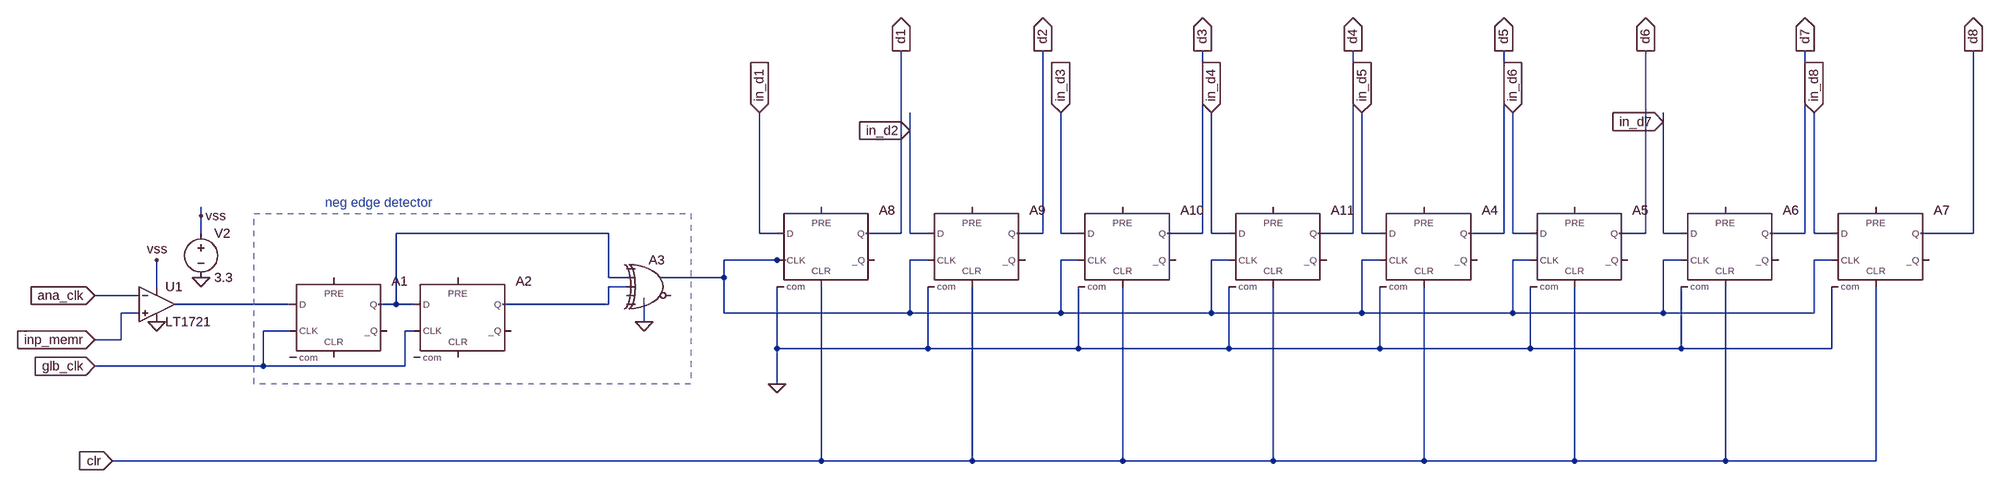
[diagram p0: schematic latch_cir.asc]
latch_cir.asc, the LTspice schematic file:
Version 4
SHEET 1 3932 680
WIRE 3312 -16 3312 -32
WIRE 1952 0 1952 -32
WIRE 672 176 672 160
WIRE 672 208 672 176
WIRE 1408 208 1024 208
WIRE 1680 208 1680 -32
WIRE 1712 208 1680 208
WIRE 1936 208 1936 -144
WIRE 1936 208 1872 208
WIRE 1952 208 1952 0
WIRE 1984 208 1952 208
WIRE 2192 208 2192 -144
WIRE 2192 208 2144 208
WIRE 2224 208 2224 -32
WIRE 2256 208 2224 208
WIRE 2480 208 2480 -144
WIRE 2480 208 2416 208
WIRE 2496 208 2496 -32
WIRE 2528 208 2496 208
WIRE 2752 208 2752 -144
WIRE 2752 208 2688 208
WIRE 2768 208 2768 -32
WIRE 2800 208 2768 208
WIRE 3024 208 3024 -144
WIRE 3024 208 2960 208
WIRE 3040 208 3040 -32
WIRE 3072 208 3040 208
WIRE 3280 208 3280 -144
WIRE 3280 208 3232 208
WIRE 3312 208 3312 -16
WIRE 3344 208 3312 208
WIRE 3568 208 3568 -144
WIRE 3568 208 3504 208
WIRE 3584 208 3584 -32
WIRE 3616 208 3584 208
WIRE 3872 208 3872 -144
WIRE 3872 208 3776 208
WIRE 1712 256 1616 256
WIRE 1728 256 1712 256
WIRE 1984 256 1952 256
WIRE 2256 256 2224 256
WIRE 2528 256 2496 256
WIRE 2800 256 2768 256
WIRE 3072 256 3040 256
WIRE 3344 256 3312 256
WIRE 3616 256 3584 256
WIRE 1408 288 1408 208
WIRE 1440 288 1408 288
WIRE 1616 288 1616 256
WIRE 1616 288 1504 288
WIRE 592 304 592 256
WIRE 1440 304 1408 304
WIRE 560 320 480 320
WIRE 832 336 624 336
WIRE 1024 336 1024 208
WIRE 1024 336 992 336
WIRE 1056 336 1024 336
WIRE 1408 336 1408 304
WIRE 1408 336 1216 336
WIRE 560 352 528 352
WIRE 1616 352 1616 288
WIRE 1952 352 1952 256
WIRE 1952 352 1616 352
WIRE 2224 352 2224 256
WIRE 2224 352 1952 352
WIRE 2496 352 2496 256
WIRE 2496 352 2224 352
WIRE 2768 352 2768 256
WIRE 2768 352 2496 352
WIRE 3040 352 3040 256
WIRE 3040 352 2768 352
WIRE 3312 352 3312 256
WIRE 3312 352 3040 352
WIRE 3584 352 3584 256
WIRE 3584 352 3312 352
WIRE 1472 368 1472 336
WIRE 832 384 784 384
WIRE 1056 384 1040 384
WIRE 528 400 528 352
WIRE 528 400 480 400
WIRE 1712 416 1712 304
WIRE 1984 416 1984 304
WIRE 1984 416 1712 416
WIRE 2256 416 2256 304
WIRE 2256 416 1984 416
WIRE 2528 416 2528 304
WIRE 2528 416 2256 416
WIRE 2800 416 2800 304
WIRE 2800 416 2528 416
WIRE 3072 416 3072 304
WIRE 3072 416 2800 416
WIRE 3344 416 3344 304
WIRE 3344 416 3072 416
WIRE 3616 416 3616 304
WIRE 3616 416 3344 416
WIRE 784 448 784 384
WIRE 784 448 480 448
WIRE 1040 448 1040 384
WIRE 1040 448 784 448
WIRE 1712 480 1712 416
WIRE 1792 624 1792 304
WIRE 1792 624 512 624
WIRE 2064 624 2064 304
WIRE 2064 624 1792 624
WIRE 2336 624 2336 304
WIRE 2336 624 2064 624
WIRE 2608 624 2608 304
WIRE 2608 624 2336 624
WIRE 2880 624 2880 304
WIRE 2880 624 2608 624
WIRE 3152 624 3152 304
WIRE 3152 624 2880 624
WIRE 3424 624 3424 304
WIRE 3424 624 3152 624
WIRE 3696 624 3696 304
WIRE 3696 624 3424 624
FLAG 592 368 0
FLAG 672 288 0
FLAG 672 176 vss
FLAG 592 256 vss
FLAG 480 320 ana_clk
IOPIN 480 320 In
FLAG 480 400 inp_memr
IOPIN 480 400 In
FLAG 480 448 glb_clk
IOPIN 480 448 In
FLAG 1472 368 0
FLAG 1712 480 0
FLAG 3872 -144 d8
IOPIN 3872 -144 Out
FLAG 3568 -144 d7
IOPIN 3568 -144 Out
FLAG 3280 -144 d6
IOPIN 3280 -144 Out
FLAG 3024 -144 d5
IOPIN 3024 -144 Out
FLAG 2752 -144 d4
IOPIN 2752 -144 Out
FLAG 2480 -144 d3
IOPIN 2480 -144 Out
FLAG 2192 -144 d2
IOPIN 2192 -144 Out
FLAG 1936 -144 d1
IOPIN 1936 -144 Out
FLAG 512 624 clr
IOPIN 512 624 In
FLAG 1680 -32 in_d1
IOPIN 1680 -32 In
FLAG 1952 0 in_d2
IOPIN 1952 0 In
FLAG 2224 -32 in_d3
IOPIN 2224 -32 In
FLAG 2496 -32 in_d4
IOPIN 2496 -32 In
FLAG 2768 -32 in_d5
IOPIN 2768 -32 In
FLAG 3040 -32 in_d6
IOPIN 3040 -32 In
FLAG 3312 -16 in_d7
IOPIN 3312 -16 In
FLAG 3584 -32 in_d8
IOPIN 3584 -32 In
SYMBOL LT1721 592 272 R0
SYMATTR InstName U1
SYMBOL Voltage 672 192 R0
SYMATTR InstName V2
SYMATTR Value 3.3
SYMBOL dflop 912 288 R0
SYMATTR InstName A1
SYMBOL dflop 1136 288 R0
SYMATTR InstName A2
SYMBOL xor 1488 240 R0
SYMATTR InstName A3
SYMBOL dflop 2880 160 R0
SYMATTR InstName A4
SYMBOL dflop 3152 160 R0
SYMATTR InstName A5
SYMBOL dflop 3424 160 R0
SYMATTR InstName A6
SYMBOL dflop 3696 160 R0
SYMATTR InstName A7
SYMBOL dflop 1792 160 R0
SYMATTR InstName A8
SYMBOL dflop 2064 160 R0
SYMATTR InstName A9
SYMBOL dflop 2336 160 R0
SYMATTR InstName A10
SYMBOL dflop 2608 160 R0
SYMATTR InstName A11
TEXT 896 152 Left 2 ;neg edge detector
RECTANGLE Normal 768 172 1556 480 1

The netlist it stands for:
* latch_cir.asc
XU1 inp_memr ana_clk vss 0 N004 LT1720  ; LT1721, pins In+ In- V+ V- OUT
V2 vss 0 3.3
A1 N004 0 glb_clk 0 0 0 N001 0 DFLOP
A2 N001 0 glb_clk 0 0 0 N003 0 DFLOP
A3 0 N001 N003 0 0 0 N002 0 XOR
A4 in_d5 0 N002 0 clr 0 d5 0 DFLOP
A5 in_d6 0 N002 0 clr 0 d6 0 DFLOP
A6 in_d7 0 N002 0 clr 0 d7 0 DFLOP
A7 in_d8 0 N002 0 clr 0 d8 0 DFLOP
A8 in_d1 0 N002 0 clr 0 d1 0 DFLOP
A9 in_d2 0 N002 0 clr 0 d2 0 DFLOP
A10 in_d3 0 N002 0 clr 0 d3 0 DFLOP
A11 in_d4 0 N002 0 clr 0 d4 0 DFLOP
* neg edge detector
.lib LTC.lib
.backanno
.end